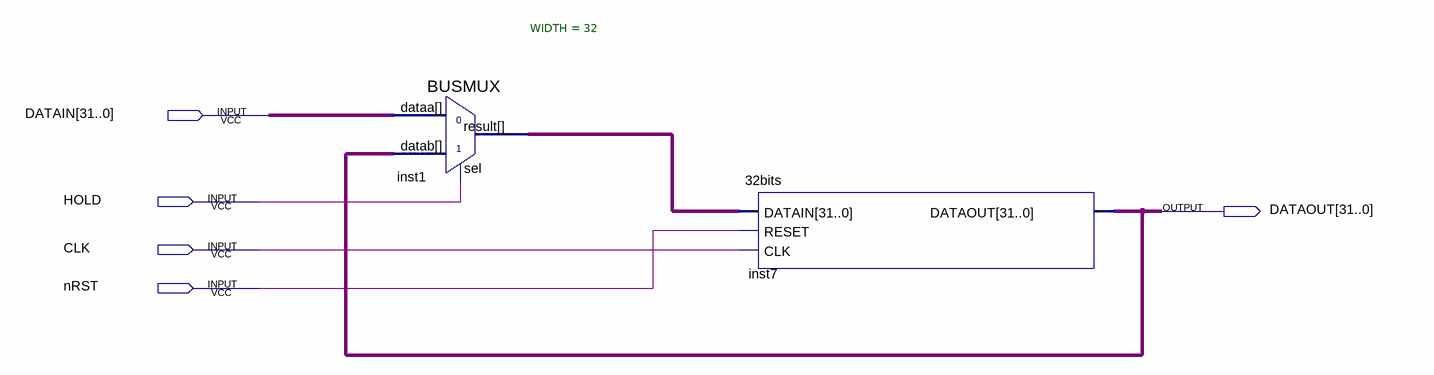
[diagram p0: schematic sheet]
// Quartus schematic REGISTRO32.bdf as structural Verilog: 2 symbols, 5 pins
module REGISTRO32 (
  input  [31:0] DATAIN,
  input  HOLD,
  input  CLK,
  input  nRST,
  output [31:0] DATAOUT
);

  wire [31:0] inst1_result;

  BUSMUX #(.WIDTH(32)) inst1 (.datab(DATAOUT), .sel(HOLD), .dataa(DATAIN), .result(inst1_result));
  \32bits  inst7 (.DATAIN(inst1_result), .RESET(nRST), .CLK(CLK), .DATAOUT(DATAOUT));
endmodule
